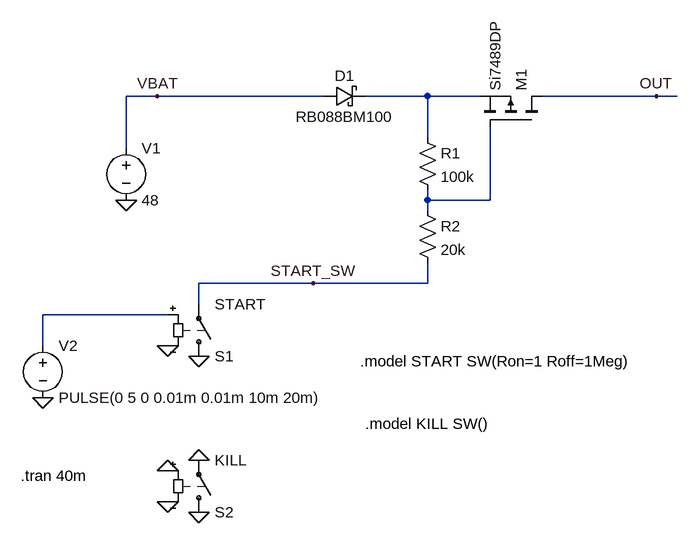
[diagram p0: schematic Draft5.asc]
Draft5.asc, the LTspice schematic file:
Version 4
SHEET 1 952 692
WIRE 48 32 0 32
WIRE 304 32 48 32
WIRE 464 32 368 32
WIRE 544 32 464 32
WIRE 816 32 640 32
WIRE 848 32 816 32
WIRE 464 96 464 32
WIRE 0 112 0 32
WIRE 464 192 464 176
WIRE 560 192 560 80
WIRE 560 192 464 192
WIRE 464 208 464 192
WIRE 288 320 112 320
WIRE 464 320 464 288
WIRE 464 320 288 320
WIRE 112 352 112 320
WIRE 64 368 -128 368
WIRE -128 416 -128 368
FLAG 0 192 0
FLAG -128 496 0
FLAG 64 416 0
FLAG 112 432 0
FLAG 64 656 0
FLAG 112 672 0
FLAG 48 32 VBAT
FLAG 816 32 OUT
FLAG 288 320 START_SW
FLAG 64 608 0
FLAG 112 592 0
SYMBOL voltage 0 96 R0
WINDOW 123 0 0 Left 0
WINDOW 39 0 0 Left 0
SYMATTR InstName V1
SYMATTR Value 48
SYMBOL schottky 304 48 R270
WINDOW 0 32 32 VTop 2
WINDOW 3 0 32 VBottom 2
SYMATTR InstName D1
SYMATTR Value RB088BM100
SYMATTR Description Diode
SYMATTR Type diode
SYMBOL pmos 640 80 M270
SYMATTR InstName M1
SYMATTR Value Si7489DP
SYMBOL voltage -128 400 R0
WINDOW 123 0 0 Left 0
WINDOW 39 0 0 Left 0
SYMATTR InstName V2
SYMATTR Value PULSE(0 5 0 0.01m 0.01m 10m 20m)
SYMBOL sw 112 448 M180
SYMATTR InstName S1
SYMATTR Value START
SYMBOL sw 112 688 M180
SYMATTR InstName S2
SYMATTR Value KILL
SYMBOL res 448 80 R0
SYMATTR InstName R1
SYMATTR Value 100k
SYMBOL res 448 192 R0
SYMATTR InstName R2
SYMATTR Value 20k
TEXT 360 440 Left 2 !.model START SW(Ron=1 Roff=1Meg)
TEXT -162 616 Left 2 !.tran 40m
TEXT 368 536 Left 2 !.model KILL SW()

The netlist it stands for:
* Draft5.asc
V1 VBAT 0 48
D1 VBAT N001 RB088BM100
M1 OUT N002 N001 N001 Si7489DP
V2 N003 0 PULSE(0 5 0 0.01m 0.01m 10m 20m)
S1 0 START_SW N003 0 START
S2 0 0 0 0 KILL
R1 N001 N002 100k
R2 N002 START_SW 20k
.model D D
.lib standard.dio
.model NMOS NMOS
.model PMOS PMOS
.lib standard.mos
.model START SW(Ron=1 Roff=1Meg)
.tran 40m
.model KILL SW()
.backanno
.end